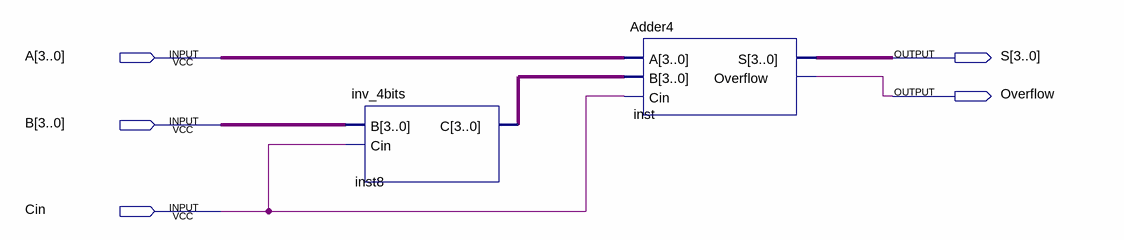
[diagram p0: schematic sheet]
// Quartus schematic AddsubDemo.bdf as structural Verilog: 2 symbols, 5 pins
module AddsubDemo (
  input  [3:0] A,
  input  [3:0] B,
  input  Cin,
  output [3:0] S,
  output Overflow
);

  wire [3:0] inst8_c;

  inv_4bits inst8 (.B(B), .Cin(Cin), .C(inst8_c));
  Adder4 inst (.A(A), .B(inst8_c), .Cin(Cin), .S(S), .Overflow(Overflow));
endmodule
